# Altium project CAN_Transceiver.PrjPcb
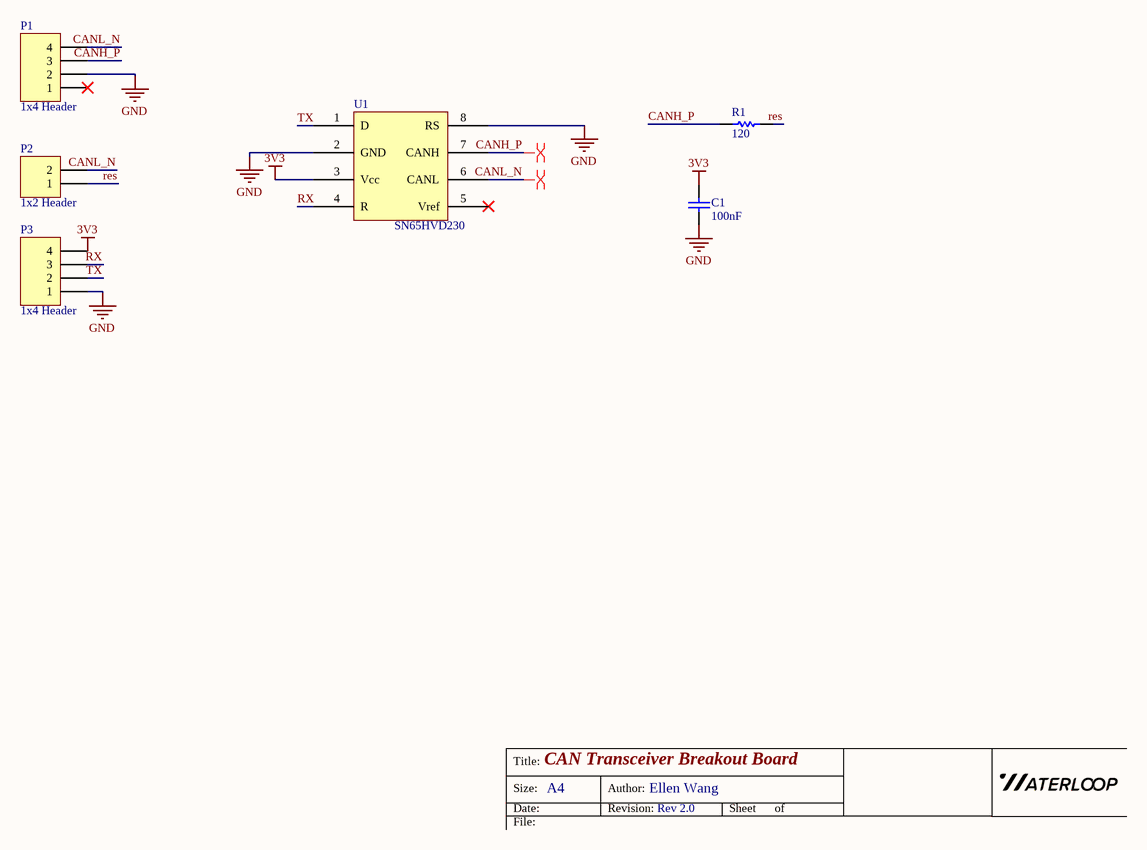
[diagram p0: CAN_Transceiver Breakout Board .SchDoc]
1 sheet, 6 parts. Net scope: global (net labels, ports and power ports of the same name join across sheets).
Board file: CAN_Transceiver Breakout Board.PcbDoc

## Sheet CAN_Transceiver Breakout Board .SchDoc
size A4; Organization: Waterloop; Address1: 200 University Ave W; Address2: Engineering 5, 1104; Address3: Waterloo, ON; Address4: N2L 3G1; SheetNumber: 1; SheetTotal: 1

### Parts
C1  value 100nF  [0805 - Capacitor]  (hidden comment: Capacitor - Nonpolarized)
P1  1x4 Header  [HDR1X4]
P2  1x2 Header  [HDR1X2]
P3  1x4 Header  [HDR1X4]
R1  value 120  [0603 - Resistor]  (hidden comment: Resistor)
U1  SN65HVD230  [SN65HVD230]  (value not drawn)

### Nets
3V3: C1.2 P3.4 U1.3(Vcc)
GND: C1.1 P1.2 P3.1 U1.2(GND) U1.8(RS)
CANH_P: P1.3 R1.1 U1.7(CANH)
CANL_N: P1.4 P2.2 U1.6(CANL)
res: P2.1 R1.2
RX: P3.3 U1.4(R)
TX: P3.2 U1.1(D)

Not connected (* = marked no-connect by the designer): P1 1*; U1 5(Vref)*

### Layout directives
differential pair: CANH_P, CANL_N

### Notes on the sheet
- Title:
- Size:
- Date:
- CAN Transceiver Breakout Board
- A4
- Author:
- Revision:
- Ellen Wang
- Rev 2.0
- Sheet
- of
- File:

### Library data of the parts
C1 = Capacitor - Nonpolarized: Nonpolarized Capacitor; Manufacturer: YAGEO; Manufacturer Part Number: CC0805KPX7R9BB104; Supplier Part Number: 13-CC0805KPX7R9BB104CT-ND; Supplier: Digikey; Rating: *
P1 P3 = 1x4 Header: 1x4 Pin Header
P2 = 1x2 Header: 1x2 Pin Header
R1 = Resistor: Manufacturer Part Number: RC0603FR-10120RL; Manufacturer: YAGEO; Rating: *; Supplier Part Number: 13-RC0603FR-10120RLCT-ND; Supplier: Digikey
U1 = SN65HVD230: 3.3V CAN Transeiver with standby